# EAGLE board Sij2 (EAGLE 7.6.0)
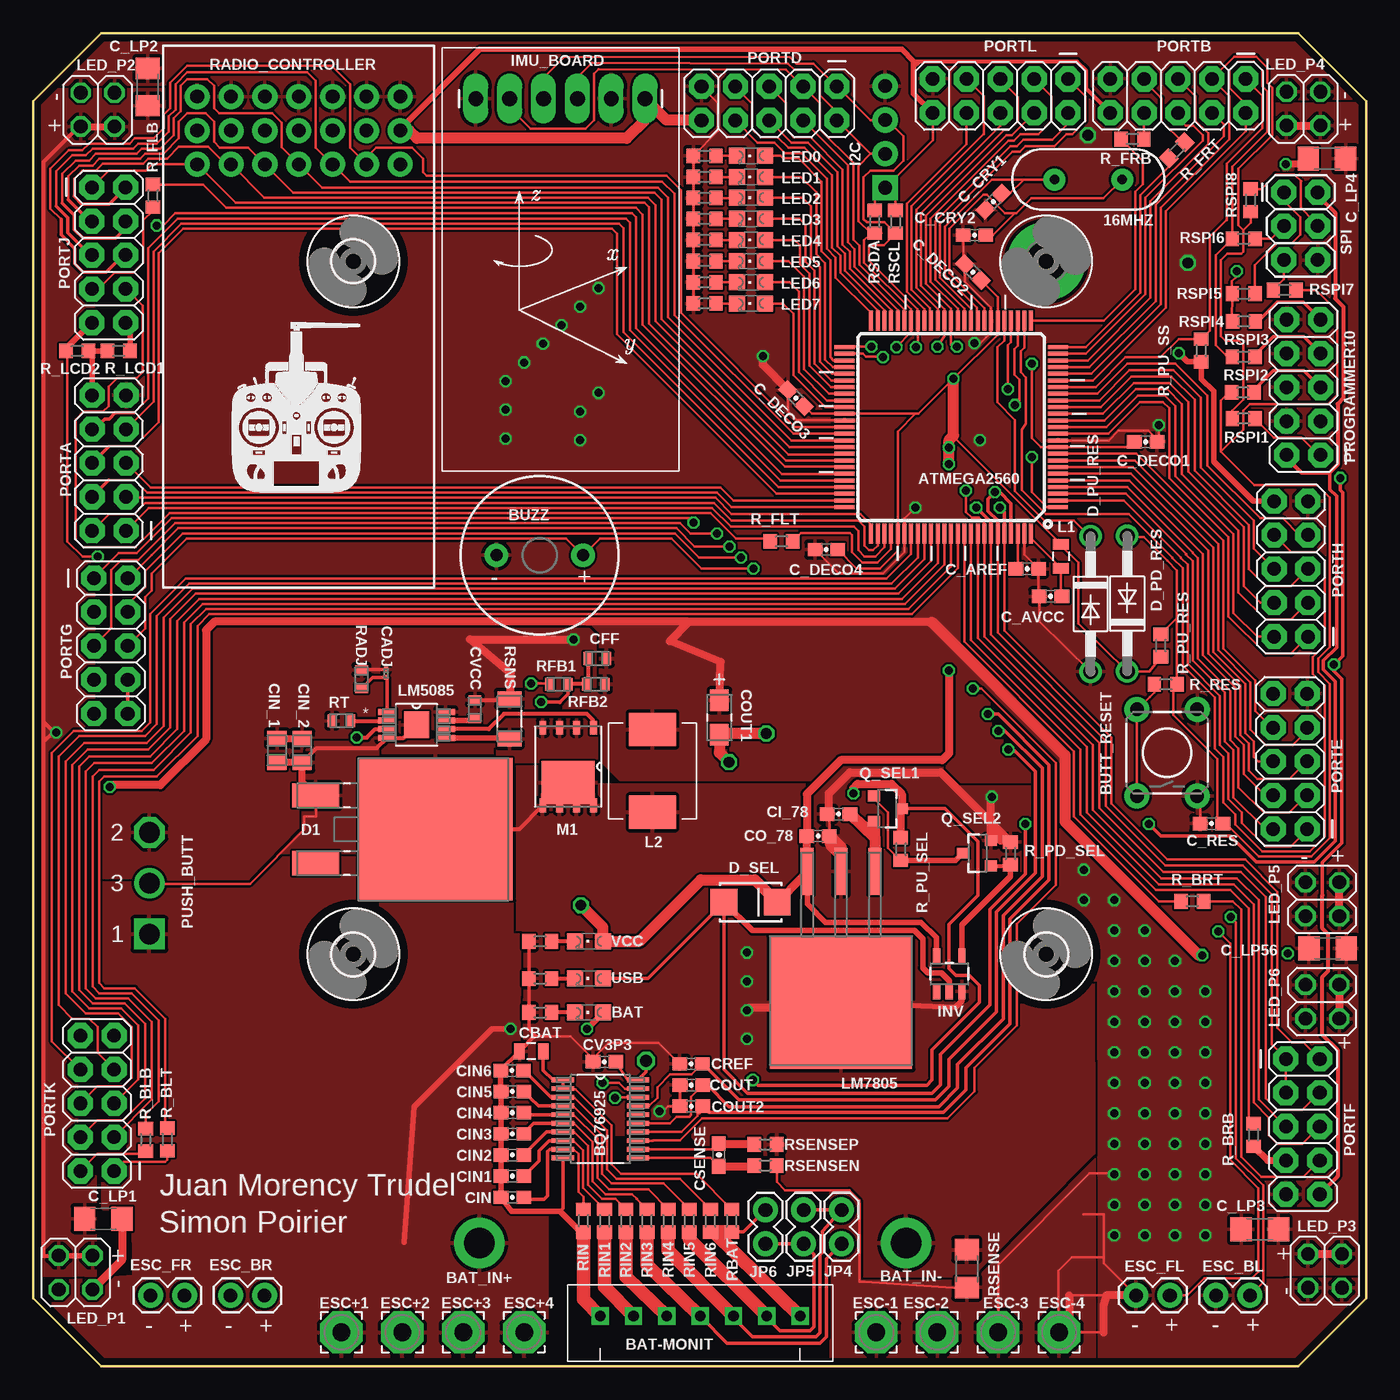
[diagram p2: board, top side]
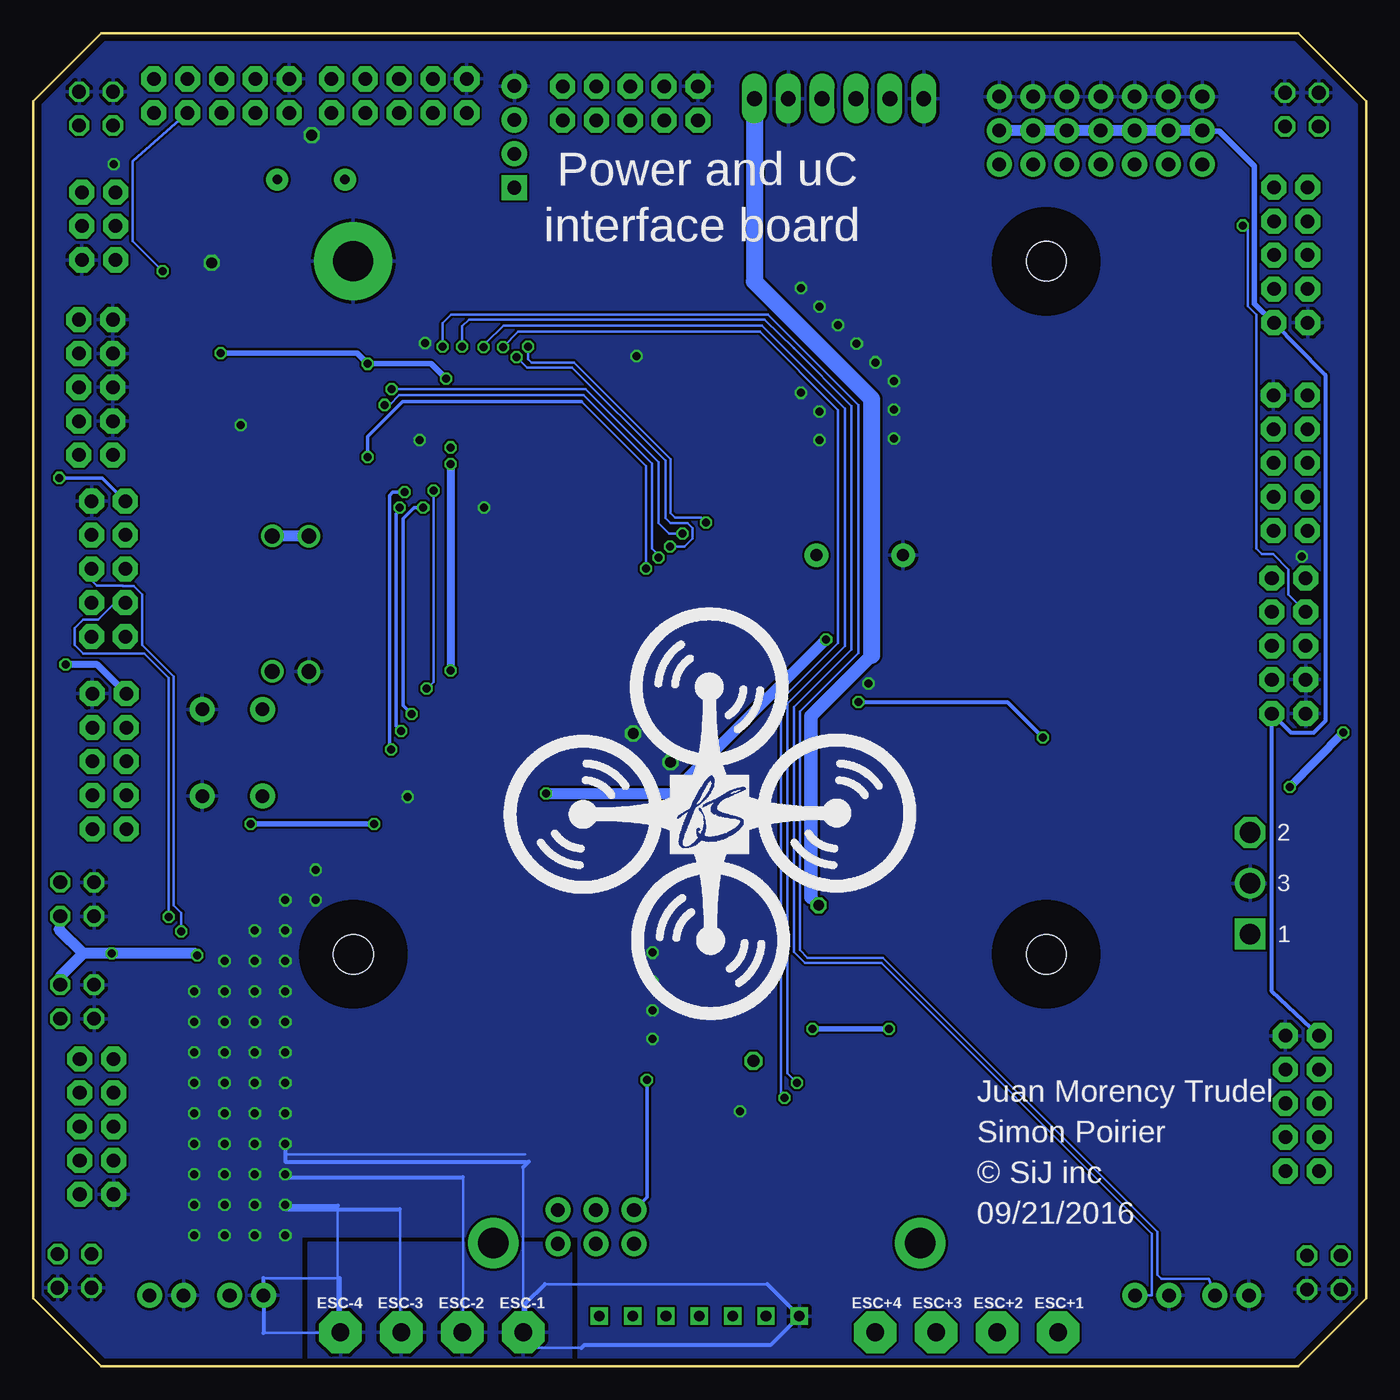
[diagram p3: board, bottom side, seen from below]

Size 100 x 100 mm. Coordinates in mm from the lower left corner, seen from the top.
Outline: 0,5.08 5.08,0 94.92,0 100,5.08 100,94.92 94.92,100 5.08,100 0,94.92 0,5.08
Copper layers (1*16): Top 0.035mm / dielectric 1.5mm / Bottom 0.035mm
Design rules "ShenZhen2U_2layer_EagleRules": minimum track width 7mil, minimum drill 12mil, track to track 7mil, track to pad 7mil, pad to pad 7mil, via to via 7mil, smd to smd 0mil, copper to edge 20mil, drill to drill 10mil, minimum pad ring 10mil, minimum via ring 6mil, stop-mask expansion 2mil, vias tented up to drill 25mil, thermal gap 10mil

## Footprints (pad centres in the part's own frame; a part is rotated, then mirrored left to right if it is on the bottom)
HC49US = drill 0.7 pad 1.651: 1 -2.54,0; 2 2.54,0
TQFP100 = smd 1.5 x 0.3: 1 -8,6; 2 -8,5.5; 3 -8,5; 4 -8,4.5; 5 -8,4; 6 -8,3.5; 7 -8,3; 8 -8,2.5; 9 -8,2; 10 -8,1.5; 11 -8,1; 12 -8,0.5; 13 -8,0; 14 -8,-0.5; 15 -8,-1; 16 -8,-1.5; 17 -8,-2; 18 -8,-2.5; 19 -8,-3; 20 -8,-3.5; 21 -8,-4; 22 -8,-4.5; 23 -8,-5; 24 -8,-5.5; 25 -8,-6; 51 8,-6; 52 8,-5.5; 53 8,-5; 54 8,-4.5; 55 8,-4; 56 8,-3.5; 57 8,-3; 58 8,-2.5; 59 8,-2; 60 8,-1.5; 61 8,-1; 62 8,-0.5; 63 8,0; 64 8,0.5; 65 8,1; 66 8,1.5; 67 8,2; 68 8,2.5; 69 8,3; 70 8,3.5; 71 8,4; 72 8,4.5; 73 8,5; 74 8,5.5; 75 8,6 | smd 0.3 x 1.5: 26 -6,-8; 27 -5.5,-8; 28 -5,-8; 29 -4.5,-8; 30 -4,-8; 31 -3.5,-8; 32 -3,-8; 33 -2.5,-8; 34 -2,-8; 35 -1.5,-8; 36 -1,-8; 37 -0.5,-8; 38 0,-8; 39 0.5,-8; 40 1,-8; 41 1.5,-8; 42 2,-8; 43 2.5,-8; 44 3,-8; 45 3.5,-8; 46 4,-8; 47 4.5,-8; 48 5,-8; 49 5.5,-8; 50 6,-8; 76 6,8; 77 5.5,8; 78 5,8; 79 4.5,8; 80 4,8; 81 3.5,8; 82 3,8; 83 2.5,8; 84 2,8; 85 1.5,8; 86 1,8; 87 0.5,8; 88 0,8; 89 -0.5,8; 90 -1,8; 91 -1.5,8; 92 -2,8; 93 -2.5,8; 94 -3,8; 95 -3.5,8; 96 -4,8; 97 -4.5,8; 98 -5,8; 99 -5.5,8; 100 -6,8
CHIPLED_0805 = smd 1.2 x 1.2: A 0,-1.05; C 0,1.05
7_PIN_JST-XH = drill 0.8 square: P$1 2.45,3.4; P$2 4.95,3.4; P$3 7.45,3.4; P$4 9.95,3.4; P$5 12.45,3.4; P$6 14.95,3.4; P$7 17.45,3.4
AWG10_HOLE_PAD = drill 2.3 pad 3.81: BAT_CONNECTOR 0,0
PW20 = smd 1.676 x 0.356: 1 -2.819,2.925; 2 -2.819,2.275; 3 -2.819,1.625; 4 -2.819,0.975; 5 -2.819,0.325; 6 -2.819,-0.325; 7 -2.819,-0.975; 8 -2.819,-1.625; 9 -2.819,-2.275; 10 -2.819,-2.925; 11 2.819,-2.925; 12 2.819,-2.275; 13 2.819,-1.625; 14 2.819,-0.975; 15 2.819,-0.325; 16 2.819,0.325; 17 2.819,0.975; 18 2.819,1.625; 19 2.819,2.275; 20 2.819,2.925
TACTILE-PTH = drill 1.016 pad 1.88: 1 -3.251,2.261; 2 3.251,2.261; 3 -3.251,-2.261; 4 3.251,-2.261
BUZZER-12MM = drill 0.9 pad 1.778: + 3.25,0; - -3.25,0
0603-CAP = smd 1.1 x 1: 1 -0.85,0; 2 0.85,0
1206 = smd 1.6 x 1.8: 1 -1.4,0; 2 1.4,0
0201 = smd 0.356 x 0.33: 1 -0.292,0; 2 0.292,0
0805 = smd 0.8 x 1.2: 1 -0.9,0; 2 0.9,0
0603 = smd 0.66 x 0.965: 1 -0.699,0; 2 0.699,0
0805' = smd 1.118 x 1.448: 1 -0.902,0; 2 0.902,0
CAPSMT_6_A09 = smd 1.6 x 1.397: 1 -1.295,0; 2 1.295,0
DDPAK = smd 1.831 x 3.501: 1 -2.54,-8.835; 3 2.54,-8.835 | smd 10.67 x 11.605: 2 0,0.152
DO41-10 = drill 1.118: A 5.08,0; C -5.08,0
SMA-DIODE_ALT = smd 2 x 2: A -2,0; C 2,0
3,17/1,3 = drill 1.321 pad 3.175 octagon: 1 0,0
1X02 = drill 1.016 pad 1.88: 1 0,0; 2 2.54,0
3,0 = hole 3: 0,0
3,0-PAD = drill 3 pad 5.842: B3,0 0,0
1X04_NO_SILK = drill 1.016 pad 1.88 square: 1 0,0 | drill 1.016 pad 1.88: 2 2.54,0; 3 5.08,0; 4 7.62,0
1X06_LONGPADS = drill 1.118 pad 1.88 long: 1 0,0; 2 2.54,0; 3 5.08,0; 4 7.62,0; 5 10.16,0; 6 12.7,0
SOT23-5 = smd 0.55 x 1.2: 1 -0.95,-1.3; 2 0,-1.3; 3 0.95,-1.3; 4 0.95,1.3; 5 -0.95,1.3
MGV0605 = smd 2.5 x 3.5: P$1 0,0; P$2 6.2,0
2X02 = drill 1.016 octagon: 1 -1.27,-1.27; 2 -1.27,1.27; 3 1.27,-1.27; 4 1.27,1.27
MUY08A = smd 1.372 x 0.457: 1 -2.197,0.975; 2 -2.197,0.325; 3 -2.197,-0.325; 4 -2.197,-0.975; 5 2.197,-0.975; 6 2.197,-0.325; 7 2.197,0.325; 8 2.197,0.975 | smd 1.88 x 2.007: 9 0,0
KTT3 = smd 0.965 x 3.505: 1 -2.54,-9.677; 2 0,-9.677; 3 2.54,-9.677 | smd 10.668 x 9.957: 4 0,0.152
POWERPAK_SO-8 = smd 1.016 x 0.508: 1 -2.921,-1.905; 2 -2.921,-0.635; 3 -2.921,0.635; 4 -2.921,1.905; 5 2.921,1.905; 6 2.921,0.635; 7 2.921,-0.635; 8 2.921,-1.905 | smd 3.226 x 3.988: 9 1.206,0
AVR_ICSP = drill 1.016 pad 1.88 octagon: 1 -1.27,5.08; 2 1.27,5.08; 3 -1.27,2.54; 4 1.27,2.54; 5 -1.27,0; 6 1.27,0; 7 -1.27,-2.54; 8 1.27,-2.54; 9 -1.27,-5.08; 10 1.27,-5.08
PUSH_BUTTON = drill 1.54 square: P$BAT 0,0 | drill 1.54: P$GND 0,-3.81 | drill 1.54 octagon: P$LOAD 0,-7.62
SOT23-3 = smd 0.8 x 0.9: 1 -0.95,-1; 2 0.95,-1; 3 0,1.1
R0603 = smd 1 x 1.1: 1 -0.85,0; 2 0.85,0
3X07 = drill 1.016 pad 1.88: 1 0,0; 2 2.54,0; 3 5.08,0; 4 7.62,0; 5 10.16,0; 6 12.7,0; 7 15.24,0; 8 0,-2.54; 9 2.54,-2.54; 10 5.08,-2.54; 11 7.62,-2.54; 12 10.16,-2.54; 13 12.7,-2.54; 14 15.24,-2.54; 15 0,-5.08; 16 2.54,-5.08; 17 5.08,-5.08; 18 7.62,-5.08; 19 10.16,-5.08; 20 12.7,-5.08; 21 15.24,-5.08
R1206 = smd 1.6 x 1.803: 1 -1.422,0; 2 1.422,0
1206' = smd 1.118 x 1.803: 1 -1.499,0; 2 1.499,0
2X3 = drill 1.016 pad 1.88 octagon: 1 0,0; 2 0,2.54; 3 2.54,0; 4 2.54,2.54; 5 5.08,0; 6 5.08,2.54

## Placement (x,y rotation side)
16MHZ  16MHz  [HC49US]  79.16,89.04 0 top
ATMEGA2560  ATMEGA2560AU  [TQFP100]  68.85,70.46 180 top
BAT  [CHIPLED_0805]  41.69,26.55 90 top
BAT-MONIT  7_PIN_JST-XH  [7_PIN_JST-XH]  40.08,0.35 0 top
BAT_IN+  AWG_10_HOLE_PAD  [AWG10_HOLE_PAD]  33.47,9.24 180 top
BAT_IN-  AWG_10_HOLE_PAD  [AWG10_HOLE_PAD]  65.49,9.24 180 top
BQ76925  BQ76925_PW_20  [PW20]  42.55,18.55 0 top
BUTT_RESET  SWITCH-MOMENTARY-2PTH  [TACTILE-PTH]  85.06,46.03 90 top
BUZZ  BUZZERPTH  [BUZZER-12MM]  37.99,60.84 180 top
C_AREF  0.1u  [0603-CAP]  74.57,59.82 0 top
C_AVCC  0.1u  [0603-CAP]  76.31,57.76 180 top
C_CRY1  22pF  [0603-CAP]  72.03,87.36 45 top
C_CRY2  22pF  [0603-CAP]  70.61,84.85 0 top
C_DECO1  0.1uF  [0603-CAP]  83.45,69.35 0 top
C_DECO2  0.1uF  [0603-CAP]  70.5,82.08 135 top
C_DECO3  0.1uF  [0603-CAP]  57.22,72.64 135 top
C_DECO4  0.1uF  [0603-CAP]  59.5,61.27 180 top
C_LP1  100uF  [1206]  5.26,11.06 0 top
C_LP2  100uF  [1206]  8.59,95.97 90 top
C_LP3  100uF  [1206]  92.02,10.26 180 top
C_LP4  100uF  [1206]  97.05,90.58 180 top
C_LP56  100uF  [1206]  97.1,31.34 180 top
C_RES  0.1uF  [0603-CAP]  88.39,40.71 180 top
CADJ  1nF  [0201]  26.47,51.97 270 top
CBAT  10uF  [0805]  37.37,23.63 180 top
CFF  680pF  [0603]  42.32,53.1 180 top
CI_78  0.22uF  [0603-CAP]  60.42,41.42 180 top
CIN  1.0uF  [0603-CAP]  35.94,12.67 180 top
CIN1  1.0uF  [0603-CAP]  35.94,14.26 180 top
CIN2  1.0uF  [0603-CAP]  35.94,15.85 180 top
CIN3  1.0uF  [0603-CAP]  35.94,17.44 180 top
CIN4  1.0uF  [0603-CAP]  35.94,19.02 180 top
CIN5  1.0uF  [0603-CAP]  35.94,20.61 180 top
CIN6  1.0uF  [0603-CAP]  35.92,22.19 180 top
CIN_1  4.7uF  [0805']  18.28,46.21 270 top
CIN_2  4.7uF  [0805']  20.17,46.19 270 top
CO_78  0.1uF  [0603-CAP]  58.87,39.77 0 top
COUT  0.1u  [0603-CAP]  49.37,21.09 180 top
COUT1  100uF  [CAPSMT_6_A09]  51.47,48.67 270 top
COUT2  1.0uF  [0603-CAP]  49.37,19.5 180 top
CREF  1.0uF  [0603-CAP]  49.35,22.68 180 top
CSENSE  0.1u  [0603-CAP]  51.43,15.85 90 top
CV3P3  4.7uF  [0603-CAP]  42.84,22.84 180 top
CVCC  1uF  [0603]  33.13,49.28 270 top
D1  700mV  [DDPAK]  30.02,40.28 270 top
D_PD_RES  1N4004  [DO41-10]  79.32,57.19 270 top
D_PU_RES  1N4004  [DO41-10]  82.08,57.21 90 top
D_SEL  CDBA320L  [SMA-DIODE_ALT]  53.82,34.81 0 top
ESC+1  WIREPAD3,17/1,3  [3,17/1,3]  23.11,2.54 0 top
ESC+2  WIREPAD3,17/1,3  [3,17/1,3]  27.69,2.54 0 top
ESC+3  WIREPAD3,17/1,3  [3,17/1,3]  32.26,2.54 0 top
ESC+4  WIREPAD3,17/1,3  [3,17/1,3]  36.83,2.54 0 top
ESC-1  WIREPAD3,17/1,3  [3,17/1,3]  63.25,2.54 0 top
ESC-2  WIREPAD3,17/1,3  [3,17/1,3]  67.82,2.54 0 top
ESC-3  WIREPAD3,17/1,3  [3,17/1,3]  72.39,2.54 0 top
ESC-4  WIREPAD3,17/1,3  [3,17/1,3]  76.96,2.54 0 top
ESC_BL  640455 TE connectivity  [1X02]  91.28,5.31 180 top
ESC_BR  640455 TE connectivity  [1X02]  17.34,5.31 180 top
ESC_FL  640455 TE connectivity  [1X02]  85.27,5.31 180 top
ESC_FR  640455 TE connectivity  [1X02]  11.34,5.31 180 top
H1  MOUNT-HOLE3.0  [3,0]  76,30.9 0 top
H2  MOUNT-HOLE3.0  [3,0]  24,30.9 0 top
H3  MOUNT-HOLE3.0  [3,0]  24,82.9 0 top
H4  MOUNT-PAD-ROUND3.0  [3,0-PAD]  76,82.9 0 top
I2C  [1X04_NO_SILK]  63.91,88.42 90 top
IMU_BOARD  M06_IMU  [1X06_LONGPADS]  33.2,95.1 0 top
INV  TC7SU04F  [SOT23-5]  68.72,29.44 0 top
JP4  [1X02]  60.64,9.18 90 top
JP5  [1X02]  57.79,11.72 270 top
JP6  [1X02]  54.93,9.18 90 top
L1  10uH  [0805]  77.11,60.77 270 top
L2  2.2uH  [MGV0605]  46.45,41.57 90 top
LED0  [CHIPLED_0805]  53.86,90.81 90 top
LED1  [CHIPLED_0805]  53.86,89.22 90 top
LED2  [CHIPLED_0805]  53.86,87.67 90 top
LED3  [CHIPLED_0805]  53.86,86.08 90 top
LED4  [CHIPLED_0805]  53.86,84.5 90 top
LED5  [CHIPLED_0805]  53.86,82.91 90 top
LED6  [CHIPLED_0805]  53.86,81.32 90 top
LED7  [CHIPLED_0805]  53.86,79.73 90 top
LED_P1  MALE HEADER  [2X02]  3.17,7.02 180 top
LED_P2  MALE HEADER  [2X02]  4.83,94.27 0 top
LED_P3  MALE HEADER  [2X02]  96.9,7.15 180 top
LED_P4  MALE HEADER  [2X02]  95.29,94.35 0 top
LED_P5  MALE HEADER  [2X02]  96.71,35.03 90 top
LED_P6  MALE HEADER  [2X02]  96.71,27.34 90 top
LM5085  LM5085MY/NOPB  [MUY08A]  28.75,48.12 0 top
LM7805  LM7805  [KTT3]  60.6,27.44 180 top
M1  -30V  [POWERPAK_SO-8]  40.12,44.99 270 top
PORTA  [AVR_ICSP]  5.68,67.76 180 top
PORTB  [AVR_ICSP]  85.88,95.31 270 top
PORTD  [AVR_ICSP]  55.21,94.75 270 top
PORTE  [AVR_ICSP]  94.3,45.37 180 top
PORTF  [AVR_ICSP]  95.25,17.97 0 top
PORTG  [AVR_ICSP]  5.81,54.05 0 top
PORTH  [AVR_ICSP]  94.36,59.82 180 top
PORTJ  [AVR_ICSP]  5.66,83.36 0 top
PORTK  [AVR_ICSP]  4.79,19.72 180 top
PORTL  [AVR_ICSP]  72.56,95.31 270 top
PROGRAMMER10  [AVR_ICSP]  95.31,73.44 180 top
PUSH_BUTT  PUSH_BUTTON  [PUSH_BUTTON]  8.71,32.42 180 top
Q_SEL1  DMN3099L  [SOT23-3]  64.06,41.84 270 top
Q_SEL2  DMN3023L  [SOT23-3]  70.84,38.49 90 top
R_BAT  to calc  [R0603]  38.03,26.54 180 top
R_BLB  220  [R0603]  8.43,16.98 270 top
R_BLT  220  [R0603]  10.06,17.01 270 top
R_BRB  220  [R0603]  91.54,17.35 270 top
R_BRT  220  [R0603]  86.96,34.87 0 top
R_FLB  220  [R0603]  8.98,87.81 270 top
R_FLT  220  [R0603]  56.13,61.89 180 top
R_FRB  220  [R0603]  82.47,92.06 0 top
R_FRT  220  [R0603]  85.8,91.22 45 top
R_LCD1  2k  [R0603]  6.41,76.16 0 top
R_LCD2  330  [R0603]  3.3,76.16 0 top
R_PD_SEL  10K  [R0603]  73.31,38.47 270 top
R_PU_RES  4.7k  [R0603]  84.59,54.07 270 top
R_PU_SEL  10K  [R0603]  65.09,38.79 90 top
R_PU_SS  4.7k  [R0603]  87.62,76.2 270 top
R_RES  363  [R0603]  84.96,51.15 180 top
R_USB  to calc  [R0603]  38.03,29.08 180 top
R_VCC  to calc  [R0603]  38.03,31.88 180 top
RADIO_CONTROLLER  RF_CONTROL_3X7_CON  [3X07]  12.29,95.25 0 top
RADJ  2.55k  [0603]  24.62,51.55 270 top
RBAT  100  [R0603]  52.39,10.92 90 top
RFB1  3.32k  [0603]  39.42,51.17 180 top
RFB2  10k  [0603]  42.19,51.17 180 top
RIN  100  [R0603]  41.27,10.92 90 top
RIN1  100  [R0603]  42.86,10.92 90 top
RIN2  100  [R0603]  44.45,10.92 90 top
RIN3  100  [R0603]  46.04,10.92 90 top
RIN4  100  [R0603]  47.63,10.92 90 top
RIN5  100  [R0603]  49.21,10.92 90 top
RIN6  100  [R0603]  50.8,10.92 90 top
RLED0  [R0603]  50.36,90.81 180 top
RLED1  [R0603]  50.36,89.22 180 top
RLED2  [R0603]  50.37,87.65 180 top
RLED3  [R0603]  50.36,86.08 180 top
RLED4  [R0603]  50.36,84.5 180 top
RLED5  [R0603]  50.36,82.91 180 top
RLED6  [R0603]  50.36,81.32 180 top
RLED7  [R0603]  50.36,79.73 180 top
RSCL  2K  [R0603]  64.68,85.85 270 top
RSDA  2K  [R0603]  63.14,85.86 270 top
RSENSE  1m  [R1206]  70.03,7.33 90 top
RSENSEN  1K  [R0603]  54.93,15.06 180 top
RSENSEP  1K  [R0603]  54.93,16.64 180 top
RSNS  10m  [1206']  35.73,48.57 270 top
RSPI1  500  [R0603]  90.8,71.1 0 top
RSPI2  500  [R0603]  90.74,73.06 0 top
RSPI3  500  [R0603]  90.8,75.73 0 top
RSPI4  500  [R0603]  90.83,78.39 0 top
RSPI5  500  [R0603]  90.81,80.46 0 top
RSPI6  500  [R0603]  90.81,84.59 0 top
RSPI7  500  [R0603]  93.88,80.74 180 top
RSPI8  500  [R0603]  91.33,87.47 90 top
RT  26.7k  [0603]  23.12,48.42 0 top
SPI  FEMALE 2x3  [2X3]  93.82,88.08 270 top
USB  [CHIPLED_0805]  41.69,29.09 90 top
VCC  [CHIPLED_0805]  41.69,31.88 90 top

## Tracks (layer width: path | path; a pad name or v marks a point on that pad's centre or on a via)
9_5085
  Top 0.305: M1.8 36.43,40.28 D1.2
  pour Top (rank 3): 26.42,46.9 27.43,47.92 42.16,47.92 42.16,43.6 63.63,43.6 57.99,36.92 55.93,34.76 54.1,36.51 52.32,36.39 50.47,36.51 45.72,32.04 28.12,32.85 24.51,33.06 24.64,37.88
ADJ_1085
  Top 0.254: RADJ.2 25.45,51.68 CADJ.2 26.55,51.6 LM5085.1
BAT+  (via drill 0.6)
  Top 0.305: BAT.A 42.74,26.52
  Top 0.406: 27.81,9.31 28.57,19.47 34.42,25.31 v35.81,25.31 | v41.53,25.31 42.77,26.55 BAT.A
  Bottom 0.406: v35.81,25.31 v41.53,25.31
  pour Top: 38.52,-0.05 38.56,0.15 38.56,15.95 36.45,23.15 36.47,32.31 35.92,32.31 35.92,34.75 35.86,38.16 34.8,38.15 18.29,38.1 16.51,36.23 5.05,36.23 5.59,19.6 7.11,19.6 7.11,14.39 5.21,14.39 5.21,11.85 7.49,11.85 7.52,6.72 -0.08,6.18 0.13,-0.34 17.73,0.04
BAT-
  pour Top: 49.53,17.18 49.53,18.96 50.04,19.47 68.58,19.47 69.09,19.98 69.09,20.23 70.36,21.5 70.36,23.03 73.66,27.98 79.5,29.63 79.54,16 70.87,7.28 70.61,6.77 59.64,6.79 59.44,12.36 59.69,12.61 56.13,12.61 55.37,13.37 55.37,15.41 54.86,15.91 50.8,15.91
CH1
  Top 0.178: PORTJ.1 5.65,89.7 8.44,89.7 8.9,90.17 RADIO_CONTROLLER.15 15.18,87.29 45.85,87.29 46.2,86.94 46.2,78.24 56.48,67.96 ATMEGA2560.68
  Top 0.254: 11.8,90.17 RADIO_CONTROLLER.15
CH2
  Top 0.178: ATMEGA2560.67 60.9,68.46 60.96,68.39 56.67,68.39 46.67,78.39 46.67,87.1 46.1,87.67 17.33,87.67 RADIO_CONTROLLER.16 14.42,90.17 13.11,91.48 10.92,91.48 10.03,90.59 8.64,90.59 8.26,90.21 5.21,90.21 4.7,89.7 3.68,89.7 3.06,89.08 3.06,87.77
  Top 0.254: 3.06,87.77 3.64,87.2 5.68,87.2 PORTJ.2
CH3
  Top 0.178: 2.62,87.51 2.62,89.27 3.43,90.08 4.45,90.08 4.95,90.59 8,90.59 8.38,90.97 9.78,90.97 10.92,92.11 10.92,93.38 11.56,94.02 12.93,94.02 13.56,93.38 13.56,91.86 13.99,91.43 16.11,91.43 RADIO_CONTROLLER.17 19.49,88.05 46.61,88.05 47.15,87.51 47.15,78.55 56.74,68.96 ATMEGA2560.66
  Top 0.254: 2.62,87.51 4.22,85.9 PORTJ.3
CH4
  Top 0.178: 2.17,87.24 2.17,89.46 3.17,90.46 4.19,90.46 4.7,90.97 7.75,90.97 8.13,91.35 9.53,91.35 10.54,92.37 10.54,93.64 11.05,94.14 11.05,96.05 11.56,96.56 13.06,96.56 13.56,96.05 13.56,94.4 13.95,94.02 17.91,94.02 18.64,93.28 18.64,91.44 RADIO_CONTROLLER.18 21.65,88.43 46.86,88.43 47.62,87.67 47.62,78.71 56.88,69.46 ATMEGA2560.65
  Top 0.254: 2.17,87.24 3.06,86.35 3.06,85.28 3.73,84.62 6.17,84.62 6.93,85.37 PORTJ.4
CH5
  Top 0.178: ATMEGA2560.64 57.02,69.96 48.1,78.87 48.1,87.95 47.18,88.87 23.75,88.87 RADIO_CONTROLLER.19 | 22.4,90.17 21.17,91.4 21.17,96.44 20.55,97.07 11.56,97.07 10.67,96.18 10.67,94.27 10.16,93.76 10.16,92.62 9.27,91.73 7.87,91.73 7.49,91.35 4.45,91.35 3.94,90.84 2.92,90.84 1.73,89.65 1.73,87.02
  Top 0.254: 1.73,87.02 2.57,86.17 2.57,85.06 4.27,83.36 PORTJ.5 | RADIO_CONTROLLER.19 22.4,90.17
CH6
  Top 0.178: 2.08,86.04 1.28,86.84 1.28,89.84 2.67,91.22 3.68,91.22 4.19,91.73 7.24,91.73 7.62,92.11 9.02,92.11 9.78,92.88 9.78,93.89 10.29,94.4 10.29,96.3 11.56,97.57 22.38,97.57 23.75,96.2 23.75,91.41 RADIO_CONTROLLER.20 24.49,90.18 25.72,91.42 28.41,91.42 29.23,90.59 29.23,89.57 29.49,89.32 47.5,89.32 48.58,88.24 48.58,79.03 57.15,70.46 ATMEGA2560.63
  Top 0.254: 2.08,86.04 2.08,84.88 3.1,83.86 3.1,82.71 3.73,82.08 5.46,82.08 6.74,83.36 PORTJ.6 | RADIO_CONTROLLER.20 24.46,90.17
CV3P3  (via drill 0.9)
  Top 0.178: BQ76925.20 44.58,21.47 CV3P3.1
  Top 0.254: v45.97,22.9 45.97,22.08 BQ76925.20
FB_5085  (via drill 0.6)
  Top 0.254: 39.49,49.81 40.12,50.45 RFB1.1
  Top 0.305: RFB1.1 RFB2.2 41.62,51.3 CFF.2 | 39.49,49.81 v38.1,49.82 | v24.26,47.16 25.02,47.16 25.65,47.79 LM5085.3
  Bottom 0.305: v38.1,49.82 26.92,49.82 v24.26,47.16
GND  (via drill 0.6, 0.8)
  Top 0.178: ATMEGA2560.99 74.35,60.89 C_AREF.2 75.42,57.8 C_AVCC.2 75.46,55.88 D_PD_RES.A | ATMEGA2560.11 80.7,69.46 81.42,70.18 83.66,70.18 84.51,69.33 C_DECO1.2 84.43,69.48 v84.43,70.6 | C_RES.2 87.54,42.56 BUTT_RESET.3 | 37.57,24.73 37.72,24.73 40.31,24.73 42.2,22.84 CV3P3.2 41.99,23.08 43.17,24.26 46.89,24.26 CREF.2 | COUT2.2 COUT.2 48.52,19.54 48.56,19.5 47.61,19.5 47.23,19.11 v46.98,19.11 | PORTD.9 51.39,94.76 51.39,92.68 RLED0.2 RLED1.2 49.52,89.24 RLED2.2 | RLED2.2 49.56,87.72 | RLED7.2 RLED6.2 RLED5.2 RLED4.2 RLED3.2 RLED2.2 | v66.18,64.41 65.35,63.59 ATMEGA2560.81 65.35,61.07 63.75,59.47 60.45,59.47 C_DECO4.2 | v70.61,76.75 71.06,76.75 71.85,77.54 ATMEGA2560.32 71.85,79.43 69.9,81.38 C_DECO2.2 69.81,82.77 C_CRY2.1 | RFB1.2 38.67,51.22 v37.34,51.22 | v4.83,60.73 3.7,60.73 2.54,61.89 2.54,76.07 R_LCD2.1 | D1.1 21.21,41.24 20.32,41.26 20.32,40.26 16.26,36.2 9.23,36.2 PUSH_BUTT.P$GND | RSENSEN.1 55.78,13.82 56.39,13.21 61.21,13.21 61.98,12.45 61.98,6.35 62.36,6.35 69.59,5.84 RSENSE.1 | 77.72,5.31 ESC_FL.2 80.31,7.72 80.31,8.18 | 80.29,2.54 ESC-4.1 | 80.31,8.18 77.93,8.18 76.91,7.16 76.91,2.49 | 80.31,8.18 80.31,11.38 78.79,11.38 | ATMEGA2560.62 60.82,70.99 57.28,70.99 56.62,71.65 C_DECO3.2 | v81.09,14.39 81,14.48 79.25,14.48 72.39,7.62 ESC-3.1 | CI_78.2 59.57,41.4 59.69,41.4 59.72,41.37 CO_78.2 59.72,39.74 59.81,39.74
  Top 0.254: BQ76925.10 39.73,11.85 39.5,11.63 | R_BAT.2 R_USB.2 R_VCC.2 | 37.18,26.32 37.18,25.27 37.72,24.73
  Top 0.305: 37.57,24.73 CBAT.2 35.07,22.23 CIN6.2 | R_BAT.2 37.18,26.32 | Q_SEL2.2 73.05,39.44 73.2,39.44 R_PD_SEL.1 | LM5085.9 27.77,47.14 LM5085.4 25.77,46.37 21.25,46.37 CIN_2.2
  Top 0.406: 63.13,26.9 LM7805.4 69.19,26.9 69.68,27.4 69.68,28 INV.3 | RIN.1 41.05,10.29 40.84,10.29 39.5,11.63 35.89,11.63 CIN.2 CIN1.2 CIN2.2 CIN3.2 CIN4.2 CIN5.2 35.07,20.64 CIN6.2 | R_LCD2.1 2.45,76.34 PORTJ.9
  Top 0.508: D1.1 20.17,43.83 CIN_2.2 20.15,45.3 CIN_1.2 | C_LP4.2 95.25,90.17 v93.98,90.17
  Top 0.61: LM7805.4 60.59,26.9 53.72,26.9 v53.53,26.71 | 77.72,5.31 77.72,3.3 ESC-4.1 | ESC_FL.2 80.49,5.31 80.29,4.57 80.29,2.54 | C_LP1.2 6.66,7.97 LED_P1.2 | 59.69,41.4 59.69,42.98 61.27,44.55 68.08,44.55 R_PD_SEL.1 | Q_SEL2.2 71.84,42.63 v71.93,42.72 | 73.05,39.44 72.58,39.44 72.08,39.93 | C_DECO3.2 54.74,75.13 v54.74,75.79
  Top 0.813: LM7805.2 60.6,36.74 60.6,38.32 | 60.6,38.32 59.81,39.11 59.81,39.74 60.6,38.95 60.6,38.32 | COUT1.2 51.47,46.04 v52.2,45.31 | v54.99,47.47 51.46,47.47 51.44,47.5
  Top 1.016: BAT-MONIT.P$1 41.27,5.03 RIN.1
  Bottom 0.178: v81.09,16.68 81.09,15.9 63.09,15.9 | 63.25,14.94 ESC-1.1 | 67.77,14.17 67.77,2.59 | 72.49,11.79 72.49,2.59 | 77.17,12.04 77.17,2.49 82.73,2.49 | 82.73,6.6 77.01,6.6 | 58.88,1.37 62.64,1.37 | 44.92,6.15 61.62,6.15
  Bottom 0.305: v81.09,16.68 81.09,15.34 62.84,15.34 63.25,14.94 | v81.09,14.39 80.87,14.17 67.77,14.17 | 67.77,2.59 68.02,2.59 68.02,2.69 67.92,2.69 | 72.49,11.79 81.09,11.79 v81.09,12.1 81.09,12.04 77.17,12.04 | 72.49,2.59 72.29,2.59 | 77.17,2.49 76.86,2.49 | 82.73,2.49 ESC_FL.2 82.73,6.6 | 77.01,6.6 77.01,2.59 76.96,2.59 | 58.88,1.37 58.67,1.57 44.71,1.57 BAT-MONIT.P$1 44.92,6.15 | 62.64,1.37 63.25,1.98 ESC-1.1 | 61.62,6.15 63.09,4.67 63.09,2.49
  other vias: 86.61,82.78 79.12,92.35 81.09,34.96 81.09,32.68 78.8,37.25 83.38,32.68 81.09,30.39 78.8,34.96 83.38,30.39 81.09,28.11 83.38,28.11 85.66,30.39 85.66,28.11 87.95,28.11 81.09,25.82 83.38,25.82 85.66,25.82 87.95,25.82 81.09,23.53 83.38,23.53 85.66,23.53 87.95,23.53 81.09,21.25 83.38,21.25 85.66,21.25 87.95,21.25 81.09,18.96 83.38,18.96 85.66,18.96 87.95,18.96 83.38,16.68 85.66,16.68 87.95,16.68 83.38,14.39 85.66,14.39 87.95,14.39 83.38,12.1 85.66,12.1 87.95,12.1 81.09,9.82 83.38,9.82 85.66,9.82 87.95,9.82 71,69.49 53.53,28.87 53.53,31.03 53.53,24.55 35.43,73.91 35.43,71.75 35.43,69.6 36.83,75.31 39.62,78.11 38.23,76.71 41.02,79.5 42.42,73.03 41.02,71.63 41.02,69.47 42.42,80.9
  pour Bottom: 0,-0.34 0,99.99 100.33,99.99 100.33,-0.34 79.91,-0.34 79.91,9.75 59.08,9.75 59.08,-0.2
  pour Top (rank 5): 104.22,-0.55 81.08,-0.51 79.96,-0.51 79.91,28.96 69.95,17.37 21.49,17.37 21.21,17.65 21.21,33.4 17.02,37.59 17.02,48.26 5.84,59.44 5.84,91.31 1.02,96.14 1.02,102.23 1.14,102.36 95,102.36 102.87,94.49 102.87,46.23 102.74,46.1 103.91,40.14
  pour Top (rank 5): 59.82,0.64 59.82,16.18 79.65,16.18 79.65,0.36 59.94,0.64
  pour Bottom (rank 6): 59.64,-0.25 59.64,9.25 79.35,9.25 79.35,-0.25
INT_IMU
  Top 0.178: IMU_BOARD.2 35.73,95.08 35.73,94.44 37.31,92.86 41.44,92.86 42.07,93.49 42.07,96.98 42.39,97.3 56.47,97.26 57.71,96.02 PORTD.3 59.02,94.75 59.02,92.78 61.52,90.29 61.52,85.7 61.52,85.65 61.52,84.53 61.98,84.07 61.98,82.65 65.33,79.3 65.33,78.49 ATMEGA2560.45
ISEN_5085
  Top 0.406: LM5085.5 35.65,47.14 RSNS.2
  pour Top: 35.43,48.9 41.78,48.9 42.04,48.39 42.04,48.26 42.29,48.01 42.29,45.59 42.04,45.34 35.31,45.34 34.8,45.85 34.8,48.51
LCD_V0
  Top 0.406: R_LCD1.1 R_LCD2.2 4.41,75.78 PORTA.10
LED_S_BLB
  Top 0.178: PORTK.2 4.8,15.91 8.22,15.91 R_BLB.2
LED_S_BLT
  Top 0.178: R_BLT.2 10.06,15.49 9.91,15.34 6.77,15.34 PORTK.1
LED_S_BRB
  Top 0.508: R_BRB.2 92.61,15.43 PORTF.7
LED_S_BRT
  Top 0.178: R_BRT.2 90,34.87 90.63,34.25 90.63,15.71 92.14,14.2 95.28,14.2 PORTF.8
LED_S_FLB
  Top 0.178: R_FLB.2 8.98,86.7 8.26,85.98 8.26,82.8 7.49,82.04 6.1,82.04 5.21,81.15 4.72,81.15 PORTJ.7
LED_S_FLT
  Top 0.178: PORTJ.8 8.19,79.56 8.19,74.59 7.75,74.14 6.29,74.14 5.65,73.51 5.65,72.05 5.21,71.6 3.75,71.6 3.17,71.03 3.17,62.01 3.73,61.45 7.7,61.45 10.25,64.01 50.8,64.01 52.71,62.1 55.28,62.1 R_FLT.2
LED_S_FRB
  Top 0.178: PORTB.8 83.32,94.02 R_FRB.2
LED_S_FRT
  Top 0.178: PORTB.7 83.34,96.42 84.55,95.22 84.61,95.16 84.63,95.14 84.63,93.42 86.23,91.83 R_FRT.2
MISO  (via drill 0.6)
  Top 0.178: RSPI4.1 89.94,78.46 RSPI5.1 89.92,80.47 RSPI5.1 89.92,80.51 89.92,81.4 90.28,81.75 v90.28,82.15 | ATMEGA2560.22 79.24,74.96 84.2,79.92 84.2,87.16 89.31,92.27 89.31,93.17 88.44,94.03 PORTB.4
  Bottom 0.178: v90.28,82.15 92.55,84.42 92.55,90.4 92.49,90.45 PORTB.4
MOSI
  Top 0.178: RSPI1.1 89.95,71.68 90.78,72.5 90.78,76.63 90.46,76.95 89.44,76.95 89.11,77.28 89.11,82.98 89.59,83.45 90.62,83.45 90.78,83.61 90.78,85.25 | ATMEGA2560.21 79.37,74.46 84.58,79.67 84.58,86.91 89.72,92.05 89.72,95.27 PORTB.3 90.11,98.26 91.76,98.26 92.58,97.43 92.58,96.29 92.96,95.91 92.96,92.37 90.42,89.83 90.42,85.6 90.78,85.25 | RSPI8.1 91.33,85.8 90.78,85.25
N$1
  Top 0.254: PROGRAMMER10.7 95.32,77.24 93.05,77.24 91.66,75.85 RSPI3.2
N$2
  Top 0.178: RSPI1.2 93.09,69.66 95.13,69.66 96.44,68.36 PROGRAMMER10.1
N$3
  Top 0.254: PROGRAMMER10.9 95.28,79.82 93.34,79.82 91.91,78.39 RSPI4.2
N$4
  Top 0.813: LM7805.1 63.14,37.36 63.14,37.37 63.14,39.64 CI_78.1 63.1,39.79 Q_SEL1.2
N$5
  Top 0.178: C_AVCC.1 77.11,58.45 L1.2 74.85,62.13 ATMEGA2560.100
N$6
  Top 0.178: ATMEGA2560.34 70.8,78.51 70.8,79.41 68.38,81.84 68.38,85.5 71.92,89.04 74.32,89.04 | 74.32,89.04 16MHZ.1 | C_CRY1.2 73.25,87.96 74.32,89.04
N$7
  Top 0.178: BQ76925.6 40.55,18.22 41.96,16.82 41.96,13.88 42.94,12.9 44.93,12.9 45.29,12.55 45.26,12.55 RIN3.2
  Top 0.254: CIN3.1 36.8,17.59 36.88,17.59 37.51,18.22 BQ76925.6
N$8
  Top 0.178: 39.78,20.76 40.68,20.76 43.38,18.06 43.38,15.13 44.09,14.41 49.74,14.41 RBAT.2
  Top 0.254: 39.78,20.76 BQ76925.2 BQ76925.1 38.98,21.47 38.26,22.2 38.26,23.62 CBAT.1
N$9
  Top 0.178: BQ76925.7 40.58,17.57 41.6,16.55 41.6,13.61 42.67,12.55 43.67,12.55 RIN2.2
  Top 0.254: CIN2.1 38.52,17.57 BQ76925.7
N$10
  Top 0.178: BQ76925.8 39.74,16.9 40.54,16.9 41.25,16.19 41.25,13.38 RIN1.2
  Top 0.254: CIN1.1 37.94,15.41 37.94,16.17 38.7,16.92 BQ76925.8
N$11
  Top 0.178: BQ76925.9 40.54,16.28 40.89,15.93 40.89,13.08 41.27,12.7 RIN.2
  Top 0.254: 40.95,12.1 RIN.2 | BQ76925.9 38.75,16.27 38.58,16.1 38.58,12.79 38.32,12.52 36.8,12.52 CIN.1
N$12
  Top 0.178: BQ76925.5 40.52,18.87 42.32,17.08 42.32,14.15 43.2,13.26 46.14,13.26 RIN4.2
  Top 0.254: BQ76925.5 36.8,18.87 CIN4.1
N$13
  Top 0.305: Q_SEL2.1 73.23,37.53 R_PD_SEL.2
  Top 0.406: INV.4 69.67,33.1 73.31,36.74 R_PD_SEL.2
N$14
  Top 0.178: ATMEGA2560.60 59.42,71.96 57.03,74.35 57.03,78.95 56.25,79.73 LED7.A
N$15
  Top 0.178: BQ76925.11 50.81,15.62 CSENSE.1
  Top 0.61: CSENSE.1 54.02,15 RSENSEN.2
N$16
  Top 0.178: BQ76925.12 51.01,16.27 CSENSE.2
  Top 0.61: CSENSE.2 54.02,16.7 RSENSEP.2
N$17
  Top 0.178: 39.77,20.13 40.6,20.13 43.03,17.7 43.03,14.77 43.74,14.06 48.51,14.06 RIN6.2
  Top 0.254: 39.77,20.13 BQ76925.3 38.85,20.17 37.31,21.71 CIN6.1
N$18
  Top 0.178: 39.75,19.5 40.53,19.5 42.67,17.35 42.67,14.41 43.38,13.7 47.28,13.7 RIN5.2
  Top 0.254: 39.75,19.5 BQ76925.4 37.9,19.52 37.29,20.14 CIN5.1 37.04,20.61
N$19
  Top 0.178: ATMEGA2560.59 59.55,72.46 57.43,74.58 57.43,80.62 56.72,81.32 LED6.A
N$20
  Top 0.178: ATMEGA2560.58 59.69,72.96 57.83,74.82 57.83,81.73 56.64,82.91 LED5.A
N$21
  Top 0.178: 61.13,73.46 ATMEGA2560.57 59.83,73.46 58.22,75.06 58.22,81.97 57.51,82.68 57.51,84.11 57.12,84.5 LED4.A
N$22
  Top 0.178: ATMEGA2560.56 59.88,73.96 58.62,75.22 58.62,82.2 57.94,82.88 57.94,85.62 57.48,86.08 LED3.A
N$23
  Top 1.016: BAT-MONIT.P$2 42.86,5.94 RIN1.1
N$24
  Top 0.178: SPI.4 95.09,86.94 95.09,88.87 95.12,88.9 94.61,89.41 93.22,89.41 92.13,88.32 RSPI8.2
N$25
  Top 0.178: ATMEGA2560.55 59.94,74.46 59.02,75.38 59.02,82.44 58.34,83.12 58.34,87.05 57.71,87.67 LED2.A
N$26
  Top 0.178: ATMEGA2560.54 59.99,74.96 59.41,75.54 59.41,82.76 58.74,83.44 58.74,88.08 57.59,89.22 LED1.A
N$27
  Top 1.016: BAT-MONIT.P$3 44.45,6.7 RIN2.1
N$28
  Top 0.254: BAT-MONIT.P$4 50.11,3.66 52.05,1.72 59.04,1.72 59.51,2.2 59.51,8.05 JP4.1
  Top 1.016: BAT-MONIT.P$4 46.04,7.61 RIN3.1
N$29
  Top 0.254: BAT-MONIT.P$5 52.46,3.69 53.96,2.2 58.72,2.2 59.04,2.51 59.04,8.37 59.2,8.53 59.2,10.12 JP4.2 JP5.1
  Top 1.016: BAT-MONIT.P$5 47.63,8.68 RIN4.1
N$30
  Top 0.254: BAT-MONIT.P$6 54.96,3.74 56.02,2.67 58.29,2.67 58.56,2.94 58.56,8.41 JP5.2 JP6.1
  Top 1.016: BAT-MONIT.P$6 49.21,9.5 RIN5.1
N$31
  Top 0.178: ATMEGA2560.53 60.05,75.46 59.81,75.7 59.81,83 59.13,83.67 59.13,88.87 57.39,90.62 56.26,90.62 56.07,90.81 LED0.A
N$34
  Top 0.178: BUTT_RESET.1 BUTT_RESET.2 83.77,50.21 84.11,50.55 R_RES.2
N$35
  Top 0.305: R_USB.1 USB.C
N$36
  Top 0.178: ATMEGA2560.33 71.36,79.36 68.73,81.99 68.73,85.34 71.27,87.88 71.53,87.88 72.9,86.51 73.66,86.51 | 16MHZ.2 80.29,87.63 74.88,87.63 73.76,86.51 73.66,86.51 | C_CRY2.2 72,84.85 73.66,86.51
N$37
  Top 0.178: Q_SEL1.1 63.06,42.61 64.14,41.53 64.14,38.89 R_PU_SEL.1
  Top 0.406: R_PU_SEL.1 69.2,37.94 Q_SEL2.3
N$38
  Top 0.305: VCC.C 40.63,31.88 R_VCC.1
N$39
  Top 0.178: LED7.C RLED7.1
N$40
  Top 0.178: RLED6.1 LED6.C
N$41
  Top 0.178: LED5.C RLED5.1
N$42
  Top 0.178: RSPI6.2 92.87,84.59 SPI.3
N$43
  Top 0.178: RLED4.1 LED4.C
N$44
  Top 0.178: LED3.C RLED3.1
N$45
  Top 0.178: RLED2.1 52.78,87.65 LED2.C
N$46
  Top 0.178: LED1.C RLED1.1
N$47
  Top 0.178: RLED0.1 LED0.C
N$48
  Top 0.305: BAT.C R_BAT.1
N$55
  Top 0.178: RSPI5.2 91.66,82.59 93.32,84.25 94.43,84.25 95.06,84.88 95.06,86.2 93.82,87.44 SPI.1
N$61
  Top 0.254: PROGRAMMER10.5 96.58,73.45 95.33,74.7 93.04,74.7 91.59,73.25 RSPI2.2
N$62
  Top 0.178: ATMEGA2560.98 73.85,59.64 C_AREF.1
N$64
  Top 0.178: SPI.5 93.82,81.57 RSPI7.2
PA0
  Top 0.178: ATMEGA2560.78 63.85,61.45 63.16,60.76 62.37,60.76 61.89,61.24 61.89,62.66 61.58,62.98 52.33,62.98 50.93,64.39 8.66,64.39 PORTA.1
  Top 0.305: PORTA.1 6.97,62.66
PA1
  Top 0.178: ATMEGA2560.77 63.35,61.59 63,61.24 62.69,61.24 62.37,61.55 62.37,62.98 61.89,63.46 52.37,63.46 51.05,64.77 8.41,64.77 7.59,63.95 5.68,63.95 PORTA.2
PA2
  Top 0.178: ATMEGA2560.76 62.85,63.13 62.05,63.93 52.4,63.93 51.18,65.15 7.02,65.15 PORTA.3
  Top 0.254: PORTA.3 6.97,65.2
PA3
  Top 0.178: 5.66,66.47 5.68,66.49 7.59,66.49 8.54,65.53 51.31,65.53 52.38,64.46 ATMEGA2560.75
  Top 0.254: PORTA.4 5.66,66.47
PA4
  Top 0.178: ATMEGA2560.74 52.52,64.96 51.56,65.91 8.8,65.91 PORTA.5
  Top 0.254: PORTA.5 7.09,67.9
PA5
  Top 0.178: ATMEGA2560.73 55.77,65.46 43.8,77.42 43.8,84.96 43.43,85.33 11.25,85.33 9.4,83.5 9.4,70.84 7.59,69.03 5.68,69.03 5.28,68.63
  Top 0.254: PORTA.6 5.28,68.63 5.66,69.01
PA6
  Top 0.178: ATMEGA2560.72 55.9,65.96 44.28,77.58 44.28,85.38 43.94,85.71 11.1,85.71 9.02,83.63 9.02,72.37 PORTA.7
  Top 0.254: PORTA.7 7.09,70.44
PA7
  Top 0.178: ATMEGA2560.71 56.04,66.46 44.76,77.74 44.76,85.79 44.45,86.09 10.85,86.09 8.64,83.88 8.64,72.6 7.59,71.55
  Top 0.254: PORTA.8 4.44,70.28 4.57,70.28 5.36,71.07 5.68,71.07 6.16,71.55 7.59,71.55
PB4
  Top 0.178: ATMEGA2560.23 79.1,75.46 83.82,80.17 83.82,87.41 88.14,91.73 88.14,92.51 87.19,93.46 87.19,95.27 PORTB.5
PB5
  Top 0.178: PORTB.6 85.88,93.66 86.49,93.05 87.03,93.05 87.73,92.35 87.73,91.96 83.44,87.67 83.44,80.43 78.97,75.96 ATMEGA2560.24
PB6
  Top 0.178: ATMEGA2560.25 78.96,76.46 83.06,80.56 83.06,87.86 85.2,90 R_FRT.1
PB7
  Top 0.178: 74.85,78.32 ATMEGA2560.26 80.32,78.46 82.68,80.81 82.68,88.11 83.26,88.7 83.26,90.42 R_FRB.1
PD3
  Top 0.178: 57.87,93.48 PORTD.4 61.11,90.11 61.11,84.33 61.62,83.82 61.62,82.5 64.87,79.25 64.87,78.49 ATMEGA2560.46
PD4
  Top 0.178: PORTD.5 56.48,94.75 56.48,92.84 57.04,92.21 58.29,92.21 60.72,89.78 60.72,84.16 61.27,83.62 61.27,82.35 64.36,79.25 64.36,78.49 ATMEGA2560.47
PD5
  Top 0.178: 55.21,93.44 PORTD.6 56.88,91.81 58.1,91.81 60.33,89.59 60.33,84.05 60.91,83.46 60.91,82.19 63.86,79.25 63.86,78.49 ATMEGA2560.48
PD6
  Top 0.178: PORTD.7 52.67,95.98 53.93,94.72 53.93,92.82 54.54,92.21 55.85,92.21 56.64,91.41 57.86,91.41 59.93,89.35 59.93,83.94 60.55,83.31 60.55,82.04 63.35,79.25 63.35,78.49 ATMEGA2560.49
PD7
  Top 0.178: 52.67,93.44 PORTD.8 54.34,91.81 55.61,91.81 56.4,91.02 57.63,91.02 59.53,89.11 59.53,83.83 60.2,83.16 60.2,81.69 62.85,79.03 ATMEGA2560.50
PE0
  Top 0.178: ATMEGA2560.2 81.82,64.96 86.11,60.67 86.11,60.64 86.61,60.13 86.61,52.7 89.03,50.29 89.03,46.61 89.66,45.97 89.66,42.55 90.68,41.53 90.68,40.77 92.46,38.99 94.36,38.99 95.57,40.2 PORTE.1
PE1
  Top 0.178: ATMEGA2560.3 81.95,65.46 86.49,60.92 86.49,60.91 86.49,60.9 87,60.39 87,52.96 89.41,50.55 89.41,46.86 90.04,46.23 90.04,42.67 92.42,40.29 PORTE.2
PE2
  Top 0.178: ATMEGA2560.4 82.09,65.96 87,61.05 87,61.02 87.38,60.64 87.38,53.09 89.79,50.67 89.79,46.99 90.42,46.35 90.42,43.43 92.33,41.53 94.23,41.53 95.54,42.83 PORTE.3
PE3
  Top 0.178: ATMEGA2560.5 82.22,66.46 87.76,60.92 87.76,53.34 90.17,50.93 90.17,47.24 90.81,46.61 90.81,44.45 92.42,42.83 PORTE.4
PE4
  Top 0.178: ATMEGA2560.6 82.36,66.96 88.14,61.18 88.14,53.47 90.55,51.05 90.55,47.37 91.19,46.74 91.19,44.7 91.82,44.07 94.23,44.07 95.54,45.37 PORTE.5
PE5
  Top 0.178: ATMEGA2560.7 82.49,67.46 88.52,61.43 88.52,53.59 90.93,51.18 90.93,47.5 91.57,46.86 91.57,45.72 91.91,45.37 PORTE.6
PE6
  Top 0.178: ATMEGA2560.8 82.63,67.96 88.9,61.69 88.9,53.72 91.31,51.31 91.31,47.75 92.46,46.61 94.49,46.61 95.57,47.69 PORTE.7
PE7
  Top 0.178: ATMEGA2560.9 82.76,68.46 89.28,61.94 89.28,53.85 91.69,51.44 91.69,49.15 92.93,47.91 PORTE.8
PF0_2  (via drill 0.6)
  Top 0.178: 72.37,62.44 ATMEGA2560.95 72.35,55.03 80.46,46.92 80.46,42.03 84.94,37.56 90.75,37.56 92.9,35.41 92.9,24.13 PORTF.1 PORTF.3 | BQ76925.17 46.21,19.52 46.82,20.13 46.82,20.92 47.77,21.88 49.39,21.88 CREF.1
  Top 0.254: CREF.1 50.25,22.68 52.96,19.98 67.69,19.98 68.71,20.99 68.71,23.02 72.26,26.58 72.26,34.07 75.18,36.99 75.18,44.62 73.53,46.27 v73.15,46.27 | ATMEGA2560.97 73.35,64.73 72.52,65.57 v72.14,65.57 71.63,65.06 71.63,64.17 72.37,63.43 72.37,62.44
  Bottom 0.254: v72.14,65.57 73.03,65.57 73.28,65.32 73.28,46.14 v73.15,46.27
PF1  (via drill 0.6)
  Top 0.178: COUT.1 49.36,20.22 49.36,18.84 49.23,18.71 48.26,18.71 47.78,18.22 BQ76925.15 | ATMEGA2560.96 72.85,55.2 80.9,47.16 80.9,42.2 85.09,38.01 90.93,38.01 93.34,35.6 93.34,25.38 94.42,24.3 95.28,24.3 PORTF.2
  Top 0.254: COUT.1 50.58,21.09 52.2,19.47 67.94,19.47 69.34,20.87 69.34,22.64 72.77,26.07 72.77,33.82 75.69,36.74 75.69,44.87 72.9,47.66 v72.39,47.66 | ATMEGA2560.96 72.85,64.09 v72.52,64.43
  Bottom 0.254: v72.52,64.43 72.52,64.17 72.77,63.92 72.77,48.04 v72.39,47.66
PF3  (via drill 0.6)
  Top 0.178: ATMEGA2560.94 71.85,54.9 79.98,46.76 79.98,41.88 84.78,37.08 90.59,37.08 92.46,35.22 92.46,20.1 93.34,19.21 95.22,19.21 PORTF.4 | COUT2.1 49.83,19.11 49.83,18.77 48.64,17.57 BQ76925.14
  Top 0.254: v70.74,64.43 71.85,63.31 ATMEGA2560.94 | v71.63,48.93 72.39,48.93 76.2,45.12 76.2,36.49 73.28,33.57 73.28,25.69 69.98,22.39 69.98,20.74 68.27,19.03 50.69,19.03 COUT2.1
  Top 0.305: COUT2.1 49.97,19.03
  Bottom 0.254: v71.63,48.93 72.26,49.57 72.26,63.6 71.44,64.43 v70.74,64.43
PF4  (via drill 0.6)
  Top 0.178: PORTF.5 91.95,20 91.95,34.96 90.31,36.61 84.62,36.61 79.51,41.72 79.51,46.6 71.35,54.76 ATMEGA2560.93 71.37,62.48 71.37,63.23 70.94,63.66 70.41,63.66 69.98,64.1 v69.98,65.7 | BQ76925.13 46.49,16.92 46.49,16.93 48.51,16.93 50.16,18.58 68.58,18.58 70.61,20.61 70.61,22.39 73.79,25.57 73.79,33.19 76.71,36.11 76.71,45.25 71.12,50.84 v70.48,50.84
  Bottom 0.178: v70.48,50.84 69.98,51.35 v69.98,65.7
PF5
  Top 0.178: ATMEGA2560.92 70.85,54.62 79.03,46.45 79.03,41.56 84.46,36.13 90.08,36.13 91.57,34.65 91.57,19.79 92.71,18.64 92.71,17.31 93.34,16.68 95.22,16.68 PORTF.6
PF6
  Top 0.178: ATMEGA2560.91 70.35,54.49 78.56,46.29 78.56,41.4 84.23,35.73 89.79,35.73 91.19,34.33 91.19,18.55 R_BRB.1
PF7
  Top 0.178: ATMEGA2560.90 69.85,54.36 78.08,46.13 78.08,41.24 84.45,34.87 R_BRT.1
PG0  (via drill 0.6)
  Top 0.178: 4.54,59.44 PORTG.1 6.41,61 7.75,61 10.38,63.63 49.15,63.63 49.53,63.25 49.49,63.25 v49.53,63.28 | v62.87,76.49 60.89,76.49 ATMEGA2560.51
  Bottom 0.178: v62.87,76.49 62.87,75.56 62.61,75.31 59.44,75.31 52.2,68.07 52.2,64.01 51.85,63.66 49.91,63.66 v49.53,63.28
PG1  (via drill 0.6)
  Top 0.178: ATMEGA2560.52 62.25,75.97 62.48,75.73 63.72,75.73 v63.73,75.71 | PORTG.2 7.11,59.09 8.89,60.87 10.88,62.87 48.26,62.87 49.62,61.5 v52.23,61.5
  Bottom 0.178: v52.23,61.5 51.15,61.5 50.55,62.1 50.55,62.87 50.93,63.25 52.2,63.25 52.58,63.63 52.58,67.94 59.56,74.93 62.95,74.93 v63.73,75.71
PG2  (via drill 0.6)
  Top 0.178: ATMEGA2560.70 56.18,66.95 45.23,77.9 45.23,86.2 44.93,86.5 10.64,86.5 9.73,85.58 v9.27,85.58
  Bottom 0.178: PORTG.3 5.84,57.89 5.84,59.78 6.99,60.92 7.85,60.92 8.26,61.33 8.26,78.91 8.89,79.54 8.89,85.25 v9.27,85.58
PG3  (via drill 0.6)
  Top 0.178: v73.64,72.12 73.98,71.96 73.98,74.03 73.61,74.41 73.61,76.31 73.85,76.56 ATMEGA2560.28 | PORTG.4 7.08,57.16 8.38,58.46 8.38,59.67 11.2,62.48 48.13,62.48 49.94,60.68 v53.09,60.68
  Bottom 0.178: v73.64,72.12 73.26,72.12 72.54,72.84 58.7,72.84 53.59,67.73 53.59,61.34 53.09,60.83 v53.09,60.68
PG4  (via drill 0.6)
  Top 0.178: v73.13,73.3 73.13,76.6 73.35,76.82 ATMEGA2560.29 | PORTG.5 5.84,55.35 5.84,59.73 6.6,60.49 7.87,60.49 10.63,63.25 48.51,63.25 49.3,62.46 v51.28,62.46
  Bottom 0.178: v73.13,73.3 58.56,73.3 53.09,67.82 53.09,63.25 52.3,62.46 v51.28,62.46
PG5  (via drill 0.6)
  Top 0.178: v74.91,68.22 74.91,65.59 76.04,64.46 ATMEGA2560.1 | PORTG.6 8.38,55.35 8.38,57.7 8.89,58.2 8.89,59.47 11.52,62.1 39.98,62.1 BUZZ.- 42.51,62.1 47.88,62.1 50.13,59.85 v54.04,59.85
  Bottom 0.178: v54.04,59.85 54.04,67.54 58.86,72.36
  Bottom 0.254: 58.86,72.36 72.29,72.36 74.91,69.75 v74.91,68.22
PGATE_5085
  Top 0.305: M1.4 42.03,48.43 41.53,48.93 35.31,48.93 34.16,47.79 LM5085.6
PH0
  Top 0.178: ATMEGA2560.12 80.64,69.96 83.03,72.35 84.75,72.35 85.22,71.87 85.22,66.63 89.66,62.19 89.66,56.26 92.46,53.47 94.36,53.47 PORTH.1
PH1
  Top 0.178: ATMEGA2560.13 80.51,70.46 82.87,72.82 84.9,72.82 85.7,72.03 85.7,66.79 90.04,62.45 90.04,56.52 91.82,54.74 PORTH.2
PH2
  Top 0.178: ATMEGA2560.14 80.37,70.96 82.72,73.3 85.06,73.3 86.17,72.19 86.17,66.95 90.42,62.7 90.42,58.04 92.46,56.01 94.36,56.01 PORTH.3
PH3  (via drill 0.6)
  Top 0.178: ATMEGA2560.15 80.24,71.46 82.56,73.77 85.22,73.77 86.65,72.35 86.65,67.11 90.81,62.95 90.81,58.55 92.07,57.28 PORTH.4 | v89.85,33.69 90.23,33.31 90.23,15.6 92.27,13.56 92.27,6.3 ESC_BL.1
  Bottom 0.178: PORTH.4 93.85,57.28 95.12,56.01 96.27,56.01 96.9,55.37 96.9,54.1 96.27,53.47 91.69,53.47 89.85,51.63 v89.85,33.69
PH4  (via drill 0.6)
  Top 0.178: ATMEGA2560.16 80.11,71.96 82.4,74.25 85.38,74.25 87.13,72.5 87.13,67.18 91.19,63.12 91.19,59.82 92.46,58.55 94.36,58.55 PORTH.5 | v88.9,32.61 89.79,31.73 89.79,15.47 91.9,13.36 91.9,7.07 91.42,6.59 87.86,6.59 86.58,5.31 ESC_FL.1
  Bottom 0.178: v88.9,32.61 88.9,34.01 89.47,34.58 89.47,51.75 91.82,54.1 91.82,57.91 92.46,58.55 93.31,58.55 95.25,58.55 95.63,58.93 PORTH.5
PH5
  Top 0.178: ATMEGA2560.17 79.97,72.46 82.24,74.73 85.54,74.73 87.6,72.66 87.6,67.43 91.57,63.46 91.57,61.34 PORTH.6
PH6
  Top 0.178: ATMEGA2560.18 79.83,72.96 82.08,75.2 85.7,75.2 88.08,72.82 88.08,67.58 92.05,63.62 92.06,63.63 93.73,63.63 94.99,62.36 PORTH.7
PH7
  Top 0.178: ATMEGA2560.27 74.35,76.42 74.08,76.15 74.08,74.57 74.48,74.17 74.48,70.71 74.18,70.28 74.18,65.73 75.97,63.93 82.21,63.93 85.47,60.67 85.47,60.64 86.23,59.88 86.23,52.58 88.65,50.16 88.65,46.35 89.28,45.72 89.28,42.29 90.17,41.4 90.17,40.64 92.2,38.61 95.76,38.61 96.9,39.75 96.9,51.05 96.01,51.94 96.01,53.21 96.9,54.1 96.9,60.45 96.27,61.09 94.38,61.09 94.37,61.08 PORTH.8
PJ6
  Top 0.178: R_FLB.1 12.73,88.66 14.48,86.91 45.21,86.91 45.72,86.4 45.72,78.14 56.39,67.47 60.83,67.47 ATMEGA2560.69
PJ7
  Top 0.178: ATMEGA2560.79 64.35,61.31 63.32,60.28 62.21,60.28 61.42,61.08 61.42,62.35 61.26,62.51 57.6,62.51 R_FLT.1
PK0
  Top 0.178: ATMEGA2560.89 69.35,59.87 65.91,56.43 13.21,56.43 12.32,55.54 12.32,47.28 9.27,44.23 5.33,44.23 4.95,43.85 4.95,28.74 5.33,28.36 7.62,28.36 9.91,26.07 9.91,18.01 R_BLT.1
PK1
  Top 0.178: ATMEGA2560.88 68.85,60 65.66,56.81 12.95,56.81 11.81,55.66 11.81,47.54 9.02,44.74 4.95,44.74 4.45,44.23 4.45,28.49 4.95,27.98 7.37,27.98 9.4,25.95 9.4,19.85 8.43,18.89 R_BLB.1
PK2
  Top 0.178: ATMEGA2560.87 68.35,60.13 65.41,57.19 12.7,57.19 11.3,55.79 11.3,47.66 8.89,45.25 4.57,45.25 3.94,44.62 3.94,28.36 4.7,27.6 7.11,27.6 8.89,25.82 8.89,20 PORTK.3
PK3
  Top 0.178: ATMEGA2560.86 67.85,60.27 65.15,57.57 12.45,57.57 10.79,55.92 10.79,47.79 8.76,45.76 4.19,45.76 3.43,45 3.43,28.23 4.45,27.22 6.86,27.22 8.38,25.69 8.38,20.1 6.73,18.45 4.8,18.45 PORTK.4
PK4
  Top 0.178: ATMEGA2560.85 67.35,60.41 64.9,57.95 12.19,57.95 10.29,56.05 10.29,47.92 8.64,46.27 4.06,46.27 2.92,45.12 2.92,28.11 4.19,26.84 6.6,26.84 7.87,25.57 7.87,21.53 PORTK.5
PK5
  Top 0.178: ATMEGA2560.84 66.85,60.54 64.64,58.33 11.94,58.33 9.78,56.17 9.78,48.04 8.51,46.77 3.81,46.77 2.41,45.38 2.41,27.98 3.94,26.45 6.35,26.45 7.37,25.44 7.37,21.63 6.73,20.99 4.8,20.99 PORTK.6
PK6
  Top 0.178: ATMEGA2560.83 66.35,60.67 64.39,58.71 11.68,58.71 9.27,56.3 9.27,48.17 8.38,47.28 3.43,47.28 1.91,45.76 1.91,27.09 2.92,26.07 4.19,26.07 4.83,25.44 4.83,23.5 PORTK.7
PK7
  Top 0.178: ATMEGA2560.82 65.85,60.94 64.01,59.09 11.43,59.09 8.76,56.43 8.76,48.3 8.13,47.66 3.05,47.66 1.4,46.01 1.4,24.39 PORTK.8
PL0
  Top 0.178: PORTL.1 78.93,95.28 78.93,93.43 77.94,92.45 77.51,92.45 76.6,91.54 74.43,91.54 74.03,91.14 73.46,91.14 68.02,85.7 68.02,81.69 70.35,79.36 ATMEGA2560.35
PL1
  Top 0.178: PORTL.2 77.64,93.21 76.44,92.01 74.27,92.01 73.8,91.54 73.3,91.54 67.67,85.9 67.67,81.53 69.85,79.35 ATMEGA2560.36
PL2
  Top 0.178: PORTL.3 76.39,95.28 76.39,93.43 75.4,92.45 74.07,92.45 73.57,91.95 73.15,91.95 67.31,86.11 67.31,81.38 69.35,79.34 ATMEGA2560.37
PL3  (via drill 0.6)
  Top 0.178: 75.09,94.11 PORTL.4 73.41,92.35 73,92.35 66.95,86.31 66.95,81.23 68.85,79.33 ATMEGA2560.38 68.85,76.64 v69.28,76.49
  Bottom 0.178: v69.28,76.49 69.28,78.27 68.64,78.91 44.9,78.91 38.1,72.11 38.1,53.51 42.48,49.12 42.48,31.22 41.91,30.64 36.26,30.64 15.68,10.07 15.68,6.86 15.37,6.54 11.81,6.54 ESC_FR.1
PL4  (via drill 0.6)
  Top 0.178: PORTL.5 72.56,96.51 73.85,95.21 73.85,93.41 73.2,92.76 72.85,92.76 66.6,86.51 66.6,81.08 68.35,79.32 ATMEGA2560.39 68.35,77.28 v67.82,76.49
  Bottom 0.178: v67.82,76.49 67.82,78.02 67.31,78.52 45.15,78.52 42.93,76.36 38.61,72.05 38.61,53.76 42.93,49.44 42.93,31.09 42.1,30.26 36.39,30.26 16.07,9.94 16.07,5.32 ESC_BR.1
PL5
  Top 0.178: ATMEGA2560.40 67.85,79.31 66.24,80.92 66.24,86.77 72.56,93.08 PORTL.6
PL6
  Top 0.178: PORTL.7 71.33,95.27 71.33,92.43 71.3,92.43 65.89,87.02 65.89,80.77 67.28,79.38 67.28,79.17 67.35,79.1 ATMEGA2560.41
PL7
  Top 0.178: PORTL.8 70.02,91.69 65.53,87.21 65.53,80.62 66.85,79.3 ATMEGA2560.42
RESET
  Top 0.178: 89.1,68.61 90.78,70.28 90.78,71.71 91.25,72.19 97.12,72.19 97.84,72.9 97.84,79.17 96.27,80.74 RSPI7.1 | 89.1,68.61 89.1,72.46 89.7,73.06 RSPI2.1 | 89.1,68.61 91.59,66.12 96.32,66.12 97.28,65.15 97.28,53.98 96.39,53.09 96.39,52.07 97.28,51.18 97.28,39.62 95.89,38.23 91.95,38.23 89.47,40.71 C_RES.1 | 85.81,56.13 R_RES.1 85.54,50.95 85.54,48.86 88.84,45.56 88.84,41.11 C_RES.1 | 85.81,56.13 85.81,59.7 85.06,60.44 83.32,62.19 82.08,62.19 D_PU_RES.A | D_PD_RES.C 79.32,62.22 78.08,63.46 75.86,63.46 73.66,65.66 73.66,70.99 72.33,72.32 72.33,76.44 72.85,76.96 ATMEGA2560.30 | 89.43,40.71 C_RES.1 | R_PU_RES.1 85.81,56.13
  Bottom 0.813: D_PD_RES.C 79.34,62.29 D_PU_RES.A
RT_5085
  Top 0.305: RT.2 26.53,48.42 LM5085.2
SCK
  Top 0.178: RSPI3.1 89.45,75.86 88.71,76.61 88.71,83.34 RSPI6.1 | RSPI6.1 89.8,84.59 | ATMEGA2560.20 79.51,73.96 84.96,79.41 84.96,86.65 90.96,92.65 PORTB.2 | 90.96,93.85 PORTB.2 | PORTB.2 90.96,94.67 89.72,95.91 89.72,97.24 90.36,97.88 91.57,97.88 92.2,97.24 92.2,96.04 92.58,95.66 92.58,92.62 89.95,90 RSPI6.1
SCL  (via drill 0.6)
  Top 0.178: IMU_BOARD.3 38.27,95.11 38.27,96.67 39.85,98.25 56.78,98.21 57.26,97.74 58.53,97.74 60.25,96.02 PORTD.1 62.81,93.5 I2C.3 64.06,93.5 65.28,92.28 65.28,90.46 64.52,89.7 62.8,89.7 62.29,89.19 62.29,86.07 62.53,85.83 63.85,85.83 RSCL.2 63.81,84.12 62.79,84.12 62.69,84.02 62.69,82.96 66.34,79.3 66.34,78.54 ATMEGA2560.43 66.35,76.79 v66.21,76.47 | BQ76925.19 44.38,20.82 43.96,21.24 v42.69,21.24
  Bottom 0.178: v66.21,76.47 66.02,76.79 64.73,78.08 45.34,78.08 39.12,71.85 39.12,54.01 43.42,49.71 43.42,21.97 v42.69,21.24
SDA  (via drill 0.6)
  Top 0.178: 62.81,90.96 PORTD.2 60.29,94.07 59,95.36 59,96.63 58.37,97.26 57.1,97.26 56.62,97.74 41.91,97.78 40.8,96.67 40.8,95.11 IMU_BOARD.4 | RSDA.2 62.84,85.01 61.89,85.91 61.89,90.04 62.81,90.96 | BQ76925.18 43.69,20.17 v43.64,20.13 | v64.75,76.47 65.85,77.57 ATMEGA2560.44 65.84,78.54 65.84,79.3 62.33,82.8 62.33,84.48 62.79,84.94 RSDA.2 | 63.61,85.01 RSDA.2 | 62.81,90.96 I2C.2 63.62,90.96
  Bottom 0.178: v64.75,76.47 63.62,77.6 45.5,77.6 39.62,71.73 39.62,54.27 43.9,49.99 43.9,20.39 v43.64,20.13
SS
  Top 0.178: ATMEGA2560.19 79.7,73.46 81.94,75.7 84.57,75.7 85.93,77.05 R_PU_SS.1 88.27,77.69 88.27,84.74 89.5,85.98 89.53,85.98 89.53,90.21 92.2,92.87 92.2,95.34 PORTB.1
V_BATT  (via drill 0.6)
  Top 0.178: 65.09,41.76 Q_SEL1.3
  Top 0.254: JP6.2 53.28,10.07 RBAT.1 | RADJ.1 24.64,52.27 CADJ.1 | Q_SEL1.3 68.4,41.84 70.87,39.37 70.87,35.31 68.71,33.15 68.71,29.84 69.22,29.34 70.23,29.34 70.99,28.57 70.99,27.3 67.44,23.75 67.44,21.46 67.06,21.08 54.36,21.08 v53.98,21.46
  Top 0.305: CVCC.1 35.63,49.97 RSNS.1
  Top 0.508: CIN_1.1 18.29,47.09 CIN_2.1
  Top 0.61: RSNS.1 35.81,50.16 35.81,51.98 32.77,54.52 v40.51,54.52 | R_PU_SEL.2 65.09,41.76 | v61.52,42.96 61.52,43.36 61.85,43.69 64.39,43.69 65.16,42.92 Q_SEL1.3
  Top 1.016: BAT-MONIT.P$7 51.16,9.97 RIN6.1 RBAT.1
  Bottom 0.254: v53.98,21.46 53.98,12.68 JP6.2
  Bottom 0.813: v61.52,42.96 52.07,42.96 v40.51,54.52
  pour Top (rank 2): 5.08,43.22 5.21,43.22 5.21,44.62 8.26,44.62 12.06,48.43 12.06,56.05 12.95,56.93 40.13,56.93 42.16,54.86 42.16,50.97 40.51,50.97 38.61,48.81 35.18,48.81 34.16,47.79 29.97,47.79 29.08,48.68 26.67,48.68 25.15,47.41 24.89,47.16 20.32,47.16 19.86,44.64 19.86,40.4 16.15,36.54 4.5,36.46 4.57,42.71
V_USB  (via drill 0.6)
  Top 0.254: v83.69,40.68 84.58,39.79 89.79,39.79 91.76,37.82 96.11,37.82 97.69,39.4 97.69,51.38 96.8,52.27 96.8,52.93 97.79,53.92 97.79,65.28 97.28,65.79 97.28,67.06 | v74.42,40.68 74.42,36.93 71.75,34.27 71.75,27.09 68.07,23.41 68.07,21.12 67.44,20.48 53.59,20.48 51.82,22.26 D_SEL.A 46.11,29.09 USB.A
  Top 0.305: 96.36,87.83 97.66,86.53 97.66,80.11 98.3,79.48 98.3,72.62 97.86,72.19 97.86,67.64 97.28,67.06 95.12,67.06 94.04,68.14 94.04,68.3
  Top 0.406: D_SEL.A 53.95,32.68 66.1,32.68 66.74,32.04 66.74,29.88 67.12,29.5 68.14,29.5 68.72,28.91 INV.2
  Top 0.508: PROGRAMMER10.2 94.04,68.3 | SPI.2 96.36,87.83
  Bottom 0.406: v74.42,40.68 v83.69,40.68
VCC  (via drill 0.6, 0.8)
  Top 0.178: ATMEGA2560.31 72.35,80.22 C_DECO2.1 | R_PU_RES.2 83.73,52.12 D_PU_RES.C 78.4,55.72 78.4,60.28 77.11,61.58 L1.1 69.03,69.75 69.03,69.83 | I2C.1 64.53,88.2 64.69,88.05 RSCL.1 | 72.35,77.41 v69.03,74.09 66.4,71.46 66.18,71.46 | 66.18,71.46 ATMEGA2560.61 58.41,71.46 C_DECO3.1 | 66.18,71.46 64.85,70.13 ATMEGA2560.80 64.85,61.21 63.5,59.85 61.77,59.85 C_DECO4.1 | v74.91,75.2 74.91,69.65 75.6,68.96 ATMEGA2560.10 82.14,68.96 C_DECO1.1 | PORTL.10 67.47,91.97 I2C.1 | RSDA.1 63.14,87.64 I2C.1 | PORTF.10 96.52,12.93
  Top 0.254: 72.35,77.41 ATMEGA2560.31 | PORTG.10 PORTG.8 | v98.04,66.65 98.04,65.72 98.23,65.53 98.23,53.28 v97.59,52.63 97.59,52.15 98.17,51.56 98.17,39.24 96.71,37.78 96.71,35.34
  Top 0.305: 96.46,12.93 96.52,12.93 97.85,14.26 97.85,23.72 96.71,24.87 96.71,29.21 97.16,29.65 97.16,32.38 96.71,32.83 96.71,35.34 | PORTB.10 78.99,95.84 78.99,97.18 78.3,97.88 66.47,97.88 | 66.47,97.88 66.13,97.88 66.04,97.79 | 66.47,97.88 66.04,97.45 66.04,97.41
  Top 0.406: 67.77,31.05 INV.5 67.77,32.15 66.61,33.31 59.42,33.31 58.07,34.67 58.07,36.72 LM7805.3 | 27.41,92.71 33.5,98.79 65.15,98.79 66.04,97.91 66.04,97.79 66.04,97.41 66.04,95.47 PORTL.10 | v85.94,76 86.58,75.36 R_PU_SS.2 87.62,74.07 88.56,73.14 88.56,67.87 91.52,64.9 PORTH.10 | R_LCD1.2 7.26,77.95 PORTJ.10
  Top 0.61: PORTD.10 50.09,93.48 | D_SEL.C 57.75,36.73 LM7805.3 58.06,39.74 CO_78.1 58.04,39.67 58.04,42.93 60.58,45.47 68.2,45.47 68.71,45.97 v68.71,52.2
  Top 0.813: 27.41,92.71 RADIO_CONTROLLER.14 28.2,92.71 28.78,92.13 44.52,92.13 45.88,93.49 45.88,95.08 IMU_BOARD.6 47.48,93.51 50.09,93.51 PORTD.10 | D_SEL.C 54.14,36.49 50.08,36.49 45.47,31.88 VCC.A 42.74,32.93 v41.08,34.58 | v68.71,67.67 v68.71,68.94 68.71,69.5 69.03,69.83 v69.03,74.09
  Bottom 0.254: PORTH.10 94.84,66.65 v98.04,66.65
  Bottom 0.305: PORTK.10 7.08,28.1 PORTG.10 5.65,47.54 3.94,47.54 3.05,48.42 3.05,74.34 3.2,74.49 | 3.11,74.4 3.2,74.49 | 3.2,74.49 PORTJ.10
  Bottom 0.406: v69.03,74.09 70.14,75.2 v74.91,75.2 75.7,76 v85.94,76 | 12.05,92.65 11.02,92.65 8.38,90.02 8.38,79.74 PORTJ.10
  Bottom 0.508: PORTE.10 95.2,52.63 v97.59,52.63
  Bottom 0.61: v68.71,67.67 v68.71,52.2
  Bottom 0.813: RADIO_CONTROLLER.14 RADIO_CONTROLLER.13 RADIO_CONTROLLER.12 RADIO_CONTROLLER.11 RADIO_CONTROLLER.10 RADIO_CONTROLLER.9 RADIO_CONTROLLER.8 12.05,92.65 | 45.91,95.09 IMU_BOARD.6 | v41.08,34.58 41.66,35.15
  Bottom 1.016: 41.66,35.15 41.66,48.77 37.08,53.34
  Bottom 1.27: 45.91,95.09 45.91,81.38 37.08,72.56 37.08,53.34
VCC_1085
  Top 0.406: LM5085.7 32.99,48.44 CVCC.2
VOUT_5085  (via drill 0.6)
  Top 0.305: LED_P2.1 3.94,93.51 0.76,90.33 0.76,48.36 | 0.76,48.36 0.76,46.84 | 0.76,46.84 0.76,8.29 LED_P1.3 | v1.71,47.54 1.52,47.6 | 1.52,47.6 0.76,48.36 | 1.52,47.6 0.76,46.84
  Top 0.406: LED_P1.3 LED_P1.1
  Top 0.508: LED_P2.1 LED_P2.3
  Top 0.61: LED_P4.1 LED_P4.3 | LED_P3.3 LED_P3.1 | LED_P5.1 LED_P5.3 | v5.71,43.47 5.84,43.6 9.53,43.6 12.95,47.03 12.95,55.22 13.59,55.85 49.14,55.85 49.17,55.82 | COUT1.1 51.56,52.85 47.75,54.39 49.17,55.82 | 67.41,55.82 49.17,55.82 | LED_P6.3 LED_P6.1
  Top 0.813: 67.41,55.82 77.41,45.82 77.41,40.87 87.44,30.84 v87.69,30.84 87.63,30.84
  Bottom 0.61: v5.71,43.47 v1.71,47.54 | v87.69,30.84 87.82,30.96
  Bottom 0.813: 87.82,30.96 v94.11,30.96 96.27,30.96 | 96.27,30.96 98.04,32.74 98.04,32.83 | LED_P6.3 97.98,29.25 96.27,30.96
  pour Top (rank 4): 41.4,46.65 38.61,50.2 42.16,56.81 65.53,56.81 68.83,60.11 70.36,60.11 70.61,59.86 70.61,54.01 72.64,51.98 72.64,51.73 79.12,45.25 76.58,45.38 76.07,43.85 44.2,43.85
  pour Top (rank 2): 93.09,94.7 100.72,94.78 100.7,91.1 100.83,90.39 100.77,6.9 96.52,6.9 92.39,6.79 92.39,11.68 96.39,11.68 97.22,88.87 96.14,89.13 89.79,88.01 90.81,91.99
  pour Top (rank 3): -0.51,6.77 4.7,6.77 4.7,14.26 3.3,14.14 3.3,47.41 4.57,48.68 4.57,90.08 5.33,90.84 8.38,90.84 9.91,92.37 9.83,95.85 -0.71,95.82

## Text on the board
tPlace: - | - | + | + | | | | | | | | | | | | | | | | | | | | | | | | | | | | | | | | | | | - | + | - | + | + | + | + | - | - | - | + | - | + | - | + | - | +
bNames: ESC+1 | ESC+2 | ESC+3 | ESC+4 | ESC-1 | ESC-2 | ESC-3 | ESC-4
tSilk: Juan Morency Trudel | Simon Poirier
_bsilk: Power and uC / interface board | Juan Morency Trudel | Simon Poirier | © SiJ inc | 09/21/2016